# EasyEDA schematic SCH_ess_macropad_2026-09-29.json
TITLE: Sheet_1; REV: 1.0; Date: 2026-09-28; Sheet: 1/1; Drawn By: yeshwant.sridaran; Company: Your Company
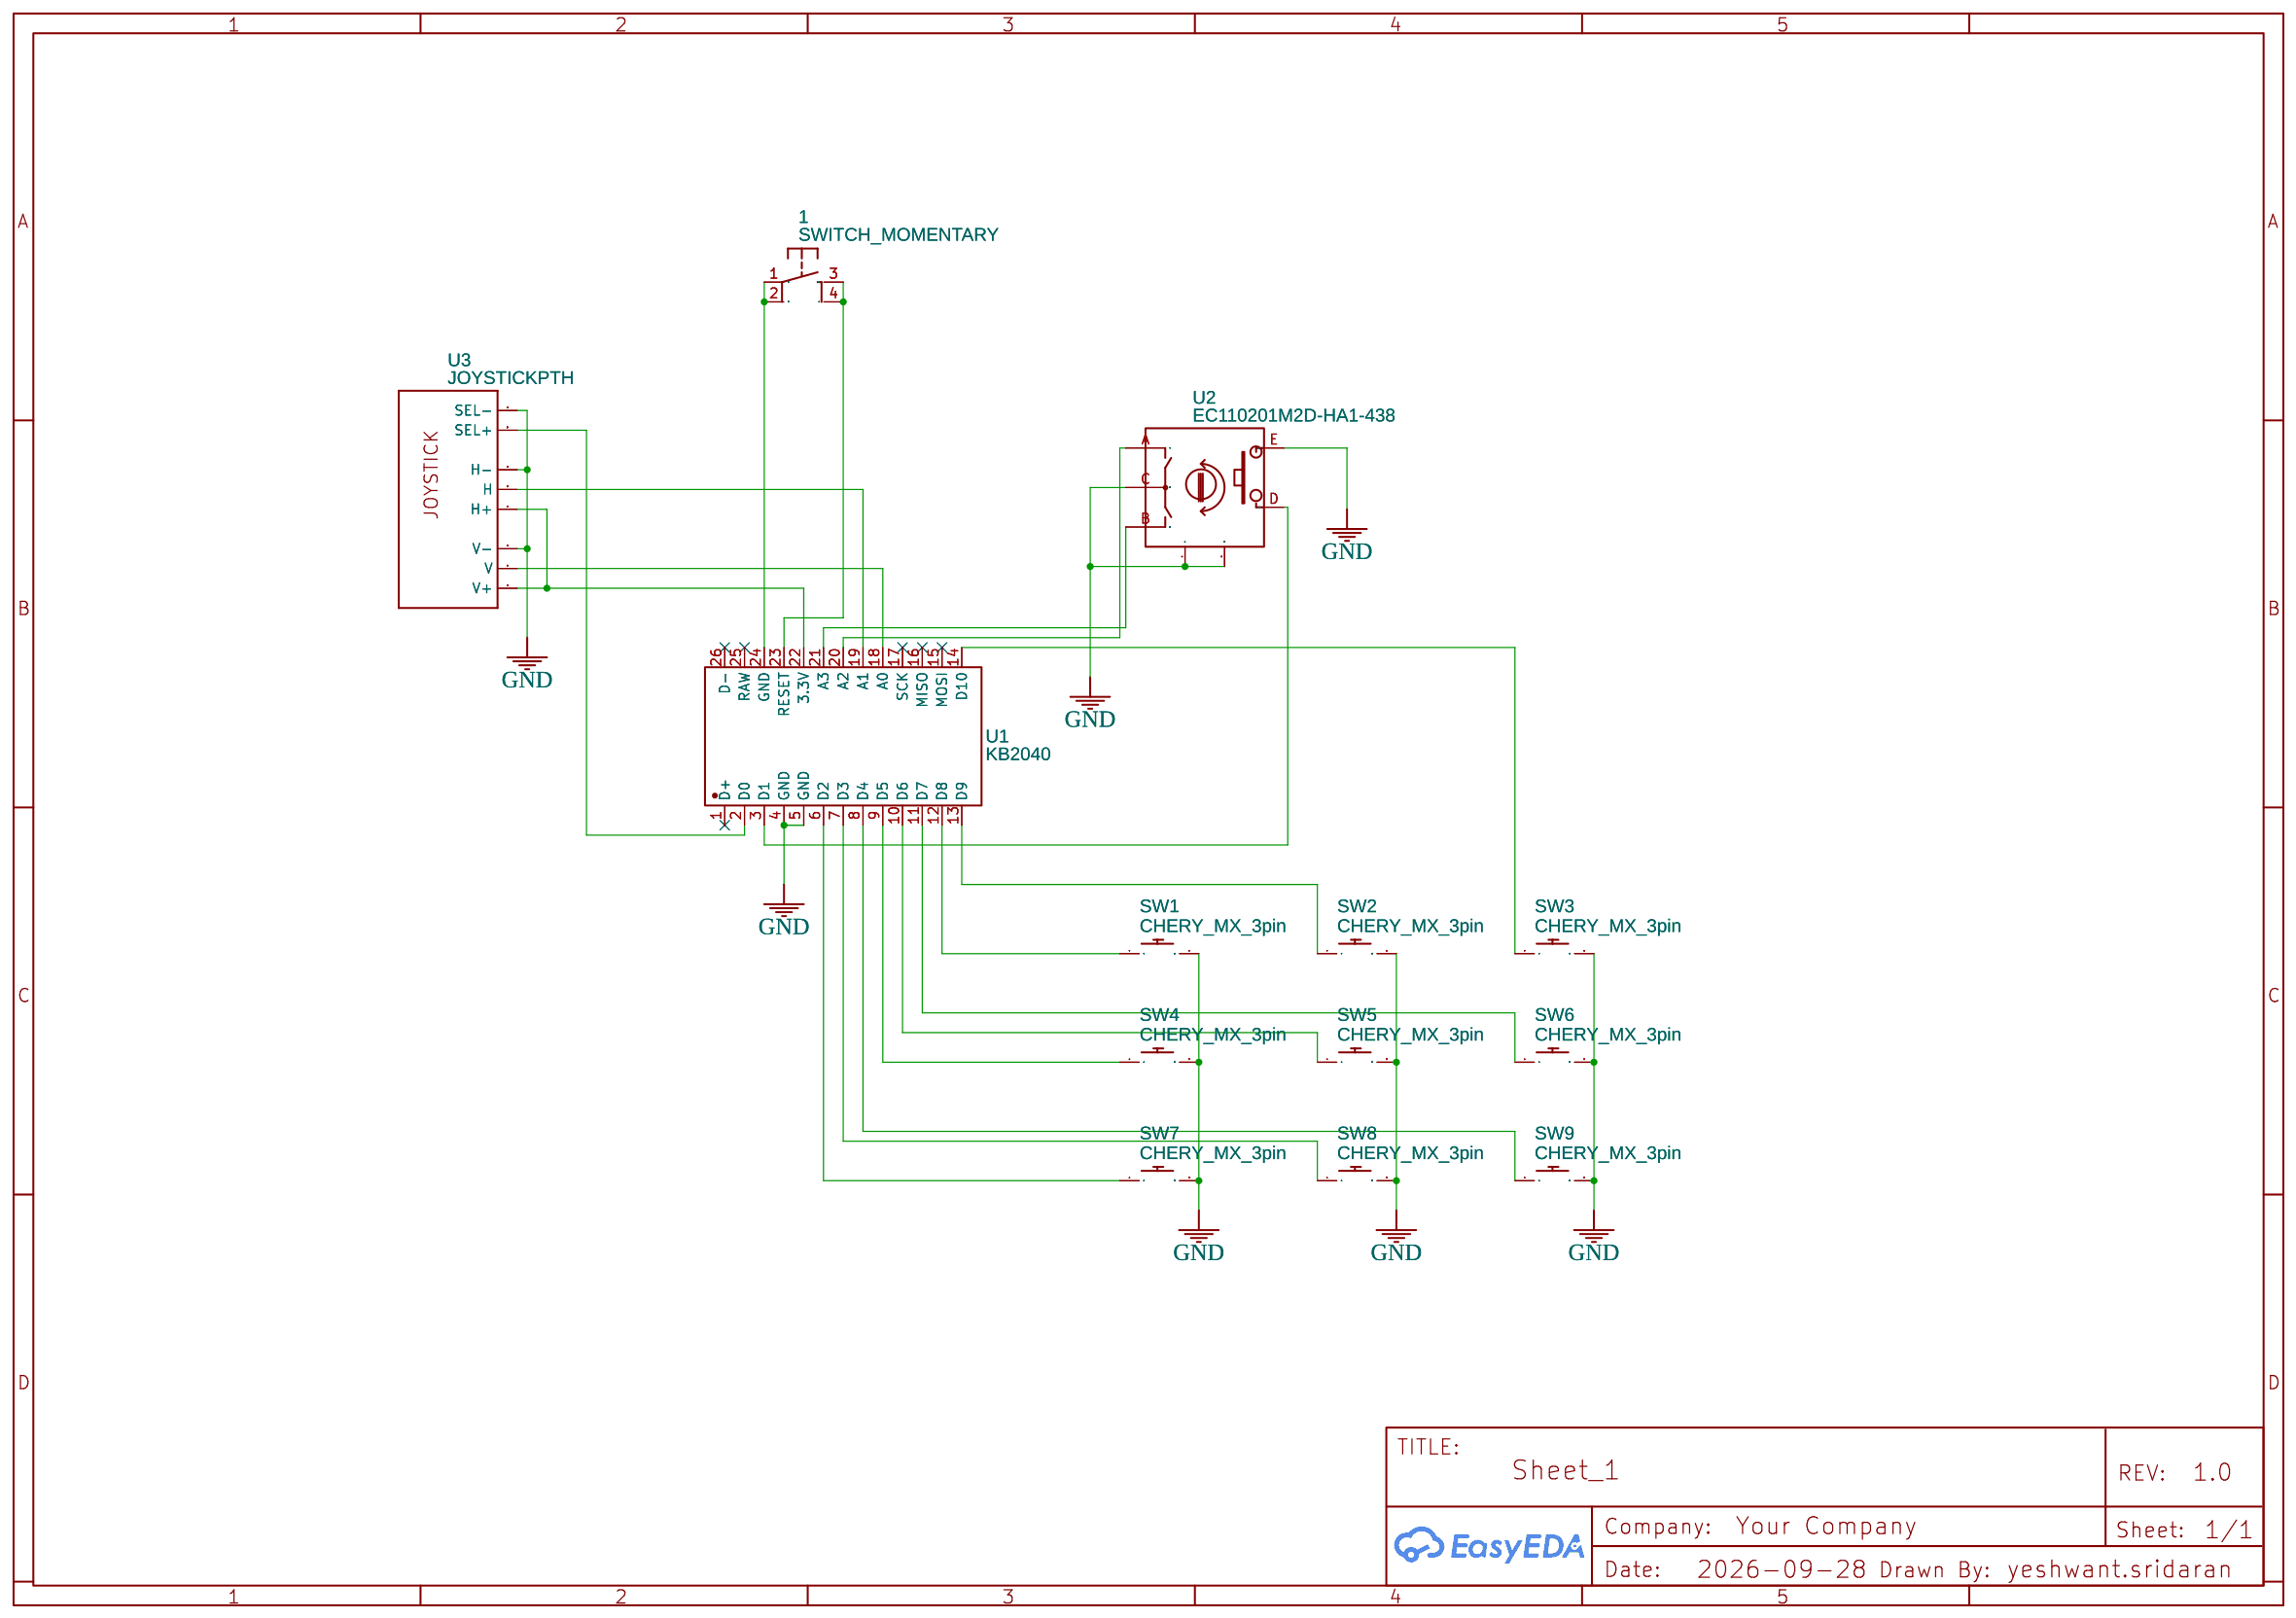
[diagram p0: schematic sheet]

## Parts
1  SWITCH_MOMENTARY  [SWITCH-MOMENTARY-PTH-6.5MM]
SW1  CHERY_MX_3pin  [CHERRY_MX_3PIN]
SW2  CHERY_MX_3pin  [CHERRY_MX_3PIN]
SW3  CHERY_MX_3pin  [CHERRY_MX_3PIN]
SW4  CHERY_MX_3pin  [CHERRY_MX_3PIN]
SW5  CHERY_MX_3pin  [CHERRY_MX_3PIN]
SW6  CHERY_MX_3pin  [CHERRY_MX_3PIN]
SW7  CHERY_MX_3pin  [CHERRY_MX_3PIN]
SW8  CHERY_MX_3pin  [CHERRY_MX_3PIN]
SW9  CHERY_MX_3pin  [CHERRY_MX_3PIN]
U1  KB2040  [COMM-SMD_L33.0-W17.8-P2.54_KB2040]
U2  EC110201M2D-HA1-438  [EC11-TH_EC110201E2J-HA1-005]
U3  JOYSTICKPTH  [JOYSTICK]

## Library data of the parts
1 = SWITCH_MOMENTARY: Contributor: ederhlf
SW1-SW9 = CHERY_MX_3pin: Contributor: max232cpe; Supplier Part: None; Manufacturer Part: CHERY MX 3pin; Manufacturer: None; link: None
U1 = KB2040: Supplier: LCSC; Supplier Part: C9900245716; Manufacturer: null; Contributor: lcsc
U2 = EC110201M2D-HA1-438: SupplierPart: C9900147604; Supplier Footprint: 非标准; Supplier: LCSC; AddInBom: yes; ConvertToPcb: yes; ModelId: 81055ca7f9194a02ae3fd4d15b654a2b|0819f05c4eef4c71ace90d822a990e87; ModelTransform: 476.26432,586.613,0,0,0,0,-0.005,0.002,-137.795; Contributor: Guilherme Fiori
U3 = JOYSTICKPTH: Thumb Joystick

## Nets
GND: SW1.2 SW2.2 SW3.2 SW4.2 SW5.2 SW6.2 SW7.2 SW8.2 SW9.2 U1.4(GND) U1.5(GND) U2.1 U2.2 U2.C U2.E U3.B2A(SEL-) U3.H3(H-) U3.V3(V-)
Net-(1-1): 1.1 1.2 U1.24(GND)
Net-(1-3): 1.3 1.4 U1.23(RESET)
Net-(SW1-1): SW1.1 U1.12(D8)
Net-(SW2-1): SW2.1 U1.13(D9)
Net-(SW3-1): SW3.1 U1.14(D10)
Net-(SW4-1): SW4.1 U1.9(D5)
Net-(SW5-1): SW5.1 U1.10(D6)
Net-(SW6-1): SW6.1 U1.11(D7)
Net-(SW7-1): SW7.1 U1.6(D2)
Net-(SW8-1): SW8.1 U1.7(D3)
Net-(SW9-1): SW9.1 U1.8(D4)
Net-(U1-2): U1.2(D0) U3.B1A(SEL+)
Net-(U1-3): U1.3(D1) U2.D
Net-(U1-18): U1.18(A0) U3.V2(V)
Net-(U1-19): U1.19(A1) U3.H2(H)
Net-(U1-20): U1.20(A2) U2.A
Net-(U1-21): U1.21(A3) U2.B
Net-(U1-22): U1.22(3.3V) U3.H1(H+) U3.V1(V+)

Not connected (* = marked no-connect by the designer): U1 1(D+)* 15(MOSI)* 16(MISO)* 17(SCK)* 25(RAW)* 26(D-)*
